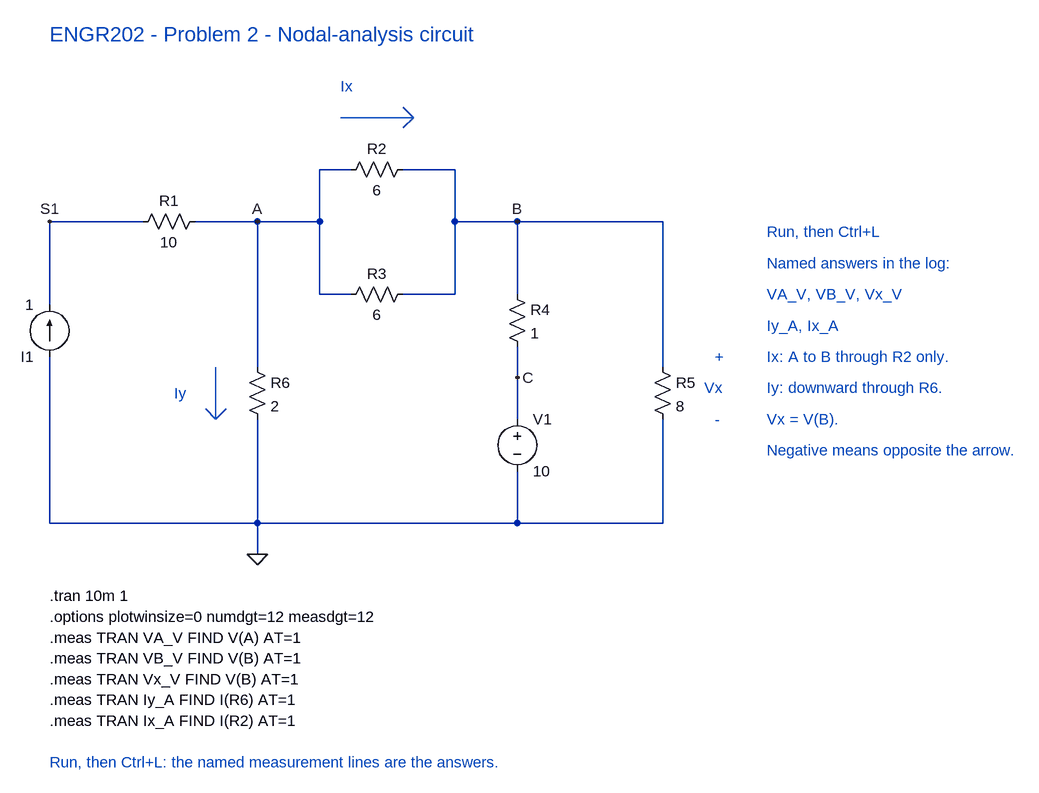
[diagram p0: schematic Problem2_Log.asc]
Problem2_Log.asc, the LTspice schematic file:
Version 4
SHEET 1 1800 1080
WIRE 80 144 224 144
WIRE 304 144 400 144
WIRE 400 144 496 144
WIRE 80 144 80 272
WIRE 80 352 80 608
WIRE 400 144 400 368
WIRE 400 448 400 608
WIRE 496 64 496 144
WIRE 496 144 496 256
WIRE 496 64 544 64
WIRE 496 256 544 256
WIRE 624 64 704 64
WIRE 704 64 704 144
WIRE 704 144 704 256
WIRE 704 256 624 256
WIRE 704 144 800 144
WIRE 800 144 1024 144
WIRE 800 144 800 256
WIRE 800 336 800 384
WIRE 800 384 800 448
WIRE 800 528 800 608
WIRE 1024 144 1024 368
WIRE 1024 448 1024 608
WIRE 80 608 400 608
WIRE 400 608 800 608
WIRE 800 608 1024 608
WIRE 400 608 400 656
FLAG 80 144 S1
FLAG 400 144 A
FLAG 800 144 B
FLAG 800 384 C
FLAG 400 656 0
SYMBOL current 80 352 R180
SYMATTR InstName I1
SYMATTR Value 1
SYMBOL res 208 160 R270
WINDOW 0 32 56 VTop 2
WINDOW 3 0 56 VBottom 2
SYMATTR InstName R1
SYMATTR Value 10
SYMBOL res 528 80 R270
WINDOW 0 32 56 VTop 2
WINDOW 3 0 56 VBottom 2
SYMATTR InstName R2
SYMATTR Value 6
SYMBOL res 528 272 R270
WINDOW 0 32 56 VTop 2
WINDOW 3 0 56 VBottom 2
SYMATTR InstName R3
SYMATTR Value 6
SYMBOL res 384 352 R0
SYMATTR InstName R6
SYMATTR Value 2
SYMBOL res 784 240 R0
SYMATTR InstName R4
SYMATTR Value 1
SYMBOL voltage 800 432 R0
SYMATTR InstName V1
SYMATTR Value 10
SYMBOL res 1008 352 R0
SYMATTR InstName R5
SYMATTR Value 8
TEXT 80 -144 Left 3 ;ENGR202 - Problem 2 - Nodal-analysis circuit
LINE Normal 528 -16 640 -16
LINE Normal 640 -16 624 -32
LINE Normal 640 -16 624 0
TEXT 528 -64 Left 2 ;Ix
LINE Normal 336 368 336 448
LINE Normal 336 448 320 432
LINE Normal 336 448 352 432
TEXT 272 408 Left 2 ;Iy
TEXT 1104 352 Left 2 ;+
TEXT 1088 400 Left 2 ;Vx
TEXT 1104 448 Left 2 ;-
TEXT 1184 160 Left 2 ;Run, then Ctrl+L
TEXT 1184 208 Left 2 ;Named answers in the log:
TEXT 1184 256 Left 2 ;VA_V, VB_V, Vx_V
TEXT 1184 304 Left 2 ;Iy_A, Ix_A
TEXT 1184 352 Left 2 ;Ix: A to B through R2 only.
TEXT 1184 400 Left 2 ;Iy: downward through R6.
TEXT 1184 448 Left 2 ;Vx = V(B).
TEXT 1184 496 Left 2 ;Negative means opposite the arrow.
TEXT 80 720 Left 2 !.tran 10m 1
TEXT 80 752 Left 2 !.options plotwinsize=0 numdgt=12 measdgt=12
TEXT 80 784 Left 2 !.meas TRAN VA_V FIND V(A) AT=1
TEXT 80 816 Left 2 !.meas TRAN VB_V FIND V(B) AT=1
TEXT 80 848 Left 2 !.meas TRAN Vx_V FIND V(B) AT=1
TEXT 80 880 Left 2 !.meas TRAN Iy_A FIND I(R6) AT=1
TEXT 80 912 Left 2 !.meas TRAN Ix_A FIND I(R2) AT=1
TEXT 80 976 Left 2 ;Run, then Ctrl+L: the named measurement lines are the answers.

The netlist it stands for:
* Problem2_Log.asc
I1 0 S1 1
R1 S1 A 10
R2 A B 6
R3 A B 6
R6 A 0 2
R4 B C 1
V1 C 0 10
R5 B 0 8
* ENGR202 - Problem 2 - Nodal-analysis circuit
* Ix
* Iy
* +
* Vx
* -
* Run, then Ctrl+L
* Named answers in the log:
* VA_V, VB_V, Vx_V
* Iy_A, Ix_A
* Ix: A to B through R2 only.
* Iy: downward through R6.
* Vx = V(B).
* Negative means opposite the arrow.
.tran 10m 1
.options plotwinsize=0 numdgt=12 measdgt=12
.meas TRAN VA_V FIND V(A) AT=1
.meas TRAN VB_V FIND V(B) AT=1
.meas TRAN Vx_V FIND V(B) AT=1
.meas TRAN Iy_A FIND I(R6) AT=1
.meas TRAN Ix_A FIND I(R2) AT=1
* Run, then Ctrl+L: the named measurement lines are the answers.
.backanno
.end